# Altium schematic sheet Connectors.SchDoc
size A4
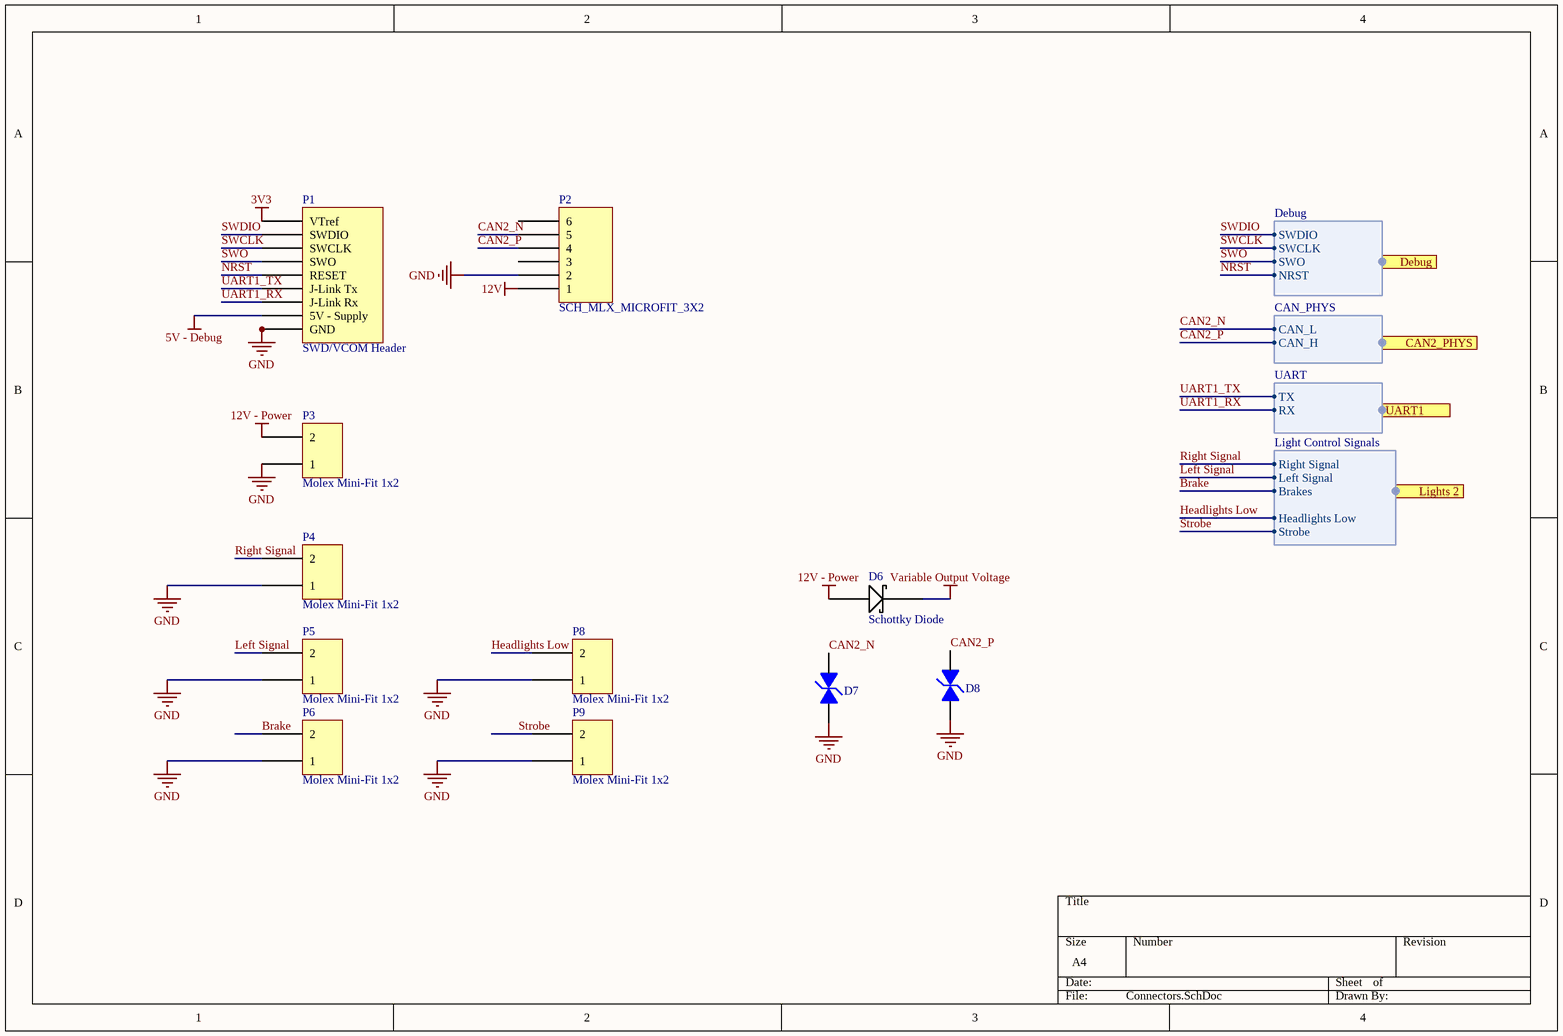
[diagram p0: Connectors.SchDoc]

## Parts
D6  Schottky Diode  [ON Semi Schottky Diode - MBRM110LT1G]
D7  TVS Diode  [TVS Diode]  (value not drawn)
D8  TVS Diode  [TVS Diode]  (value not drawn)
P1  SWD/VCOM Header  [Samtec TST-110-01-G-D]
P2  SCH_MLX_MICROFIT_3X2  [PCB_MLX_MICROFIT_3X2]
P3  Molex Mini-Fit 1x2  [Molex Mini-Fit Jr 2x1]
P4  Molex Mini-Fit 1x2  [Molex Mini-Fit Jr 2x1]
P5  Molex Mini-Fit 1x2  [Molex Mini-Fit Jr 2x1]
P6  Molex Mini-Fit 1x2  [Molex Mini-Fit Jr 2x1]
P8  Molex Mini-Fit 1x2  [Molex Mini-Fit Jr 2x1]
P9  Molex Mini-Fit 1x2  [Molex Mini-Fit Jr 2x1]

## Ports
CAN2_PHYS (harness CAN_PHYS), Debug (harness Debug), Lights 2 (harness Light Control Signals), UART1 (harness UART)

## Harnesses
Debug: SWDIO, SWCLK, SWO, NRST
CAN_PHYS: CAN_L, CAN_H
UART: TX, RX
Light Control Signals: Right Signal, Left Signal, Brakes, Headlights Low, Strobe

## Nets
3V3: P1.1(VTref)
5V - Debug: P1.19(5V_-_Supply)
12V: P2.1
12V - Power: D6.2 P3.2
GND: D7.2 D8.2 P1.4(GND) P1.6(GND) P1.8(GND) P1.10(GND) P1.12(GND) P2.2 P3.1 P4.1 P5.1 P6.1 P8.1 P9.1
Variable Output Voltage: D6.1
Brake: P6.2 ; port Lights 2.Brakes
CAN2_N: D7.1 P2.5 ; port CAN2_PHYS.CAN_L
CAN2_P: D8.1 P2.4 ; port CAN2_PHYS.CAN_H
Headlights Low: P8.2 ; port Lights 2.Headlights Low
Left Signal: P5.2 ; port Lights 2.Left Signal
NRST: P1.15(RESET) ; port Debug.NRST
Right Signal: P4.2 ; port Lights 2.Right Signal
Strobe: P9.2 ; port Lights 2.Strobe
SWCLK: P1.9(SWCLK) ; port Debug.SWCLK
SWDIO: P1.7(SWDIO) ; port Debug.SWDIO
SWO: P1.13(SWO) ; port Debug.SWO
UART1_RX: P1.17(J-Link_Rx) ; port UART1.RX
UART1_TX: P1.5(J-Link_Tx) ; port UART1.TX

Not connected (* = marked no-connect by the designer): P2 3 6

## Library data of the parts
D6 = ON Semi Schottky Diode - MBRM110LT1G
D7 D8 = TVS Diode: Manufacturer: Bourns; Manufacturer ID: CDSOD323-T03SC